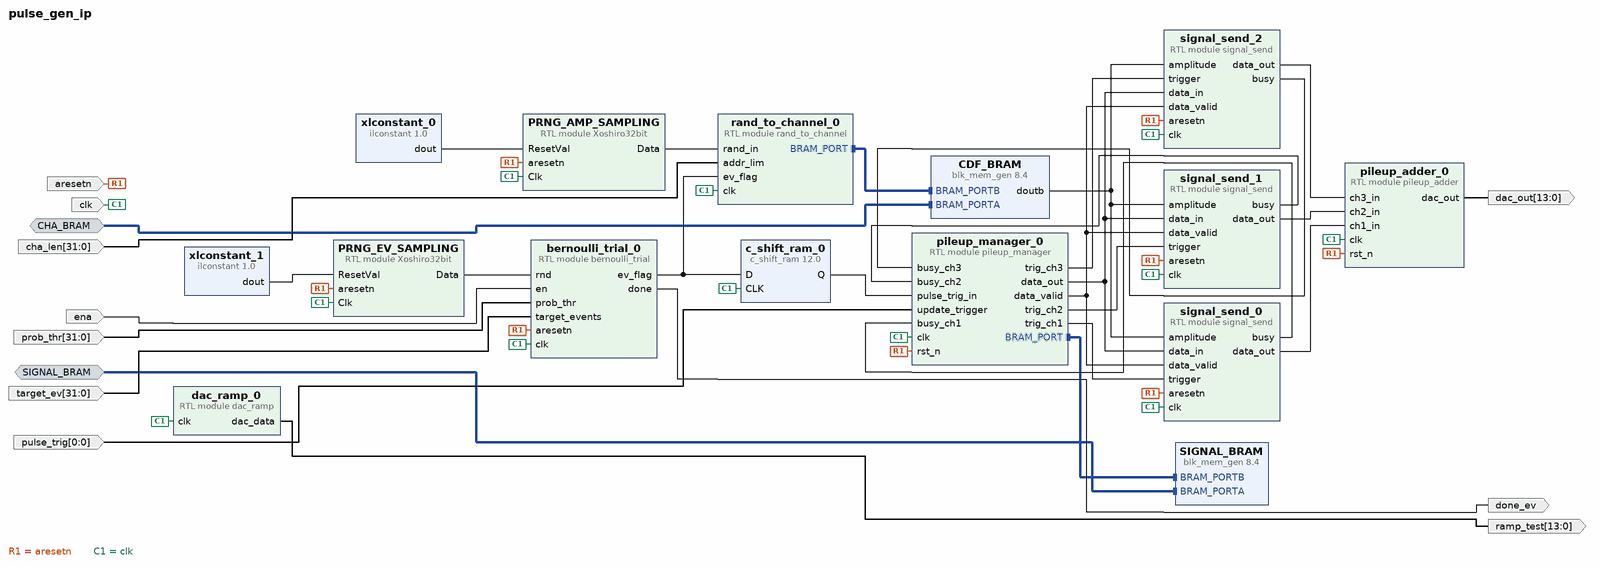
[diagram p0: block diagram of the top level]
# Vivado block design pulse_gen_ip, xck26-sfvc784-2LV-c, Vivado 2024.2
create_bd_design pulse_gen_ip

create_bd_intf_port -mode Slave -vlnv xilinx.com:interface:bram_rtl:1.0 SIGNAL_BRAM
set_property -dict {CONFIG.MASTER_TYPE BRAM_CTRL CONFIG.READ_WRITE_MODE READ_WRITE} [get_bd_intf_ports SIGNAL_BRAM]
create_bd_intf_port -mode Slave -vlnv xilinx.com:interface:bram_rtl:1.0 CHA_BRAM
set_property -dict [list \
  CONFIG.MASTER_TYPE BRAM_CTRL \
  CONFIG.MEM_SIZE 32768 \
  CONFIG.READ_WRITE_MODE READ_WRITE \
] [get_bd_intf_ports CHA_BRAM]
create_bd_port -dir I -from 0 -to 0 pulse_trig
create_bd_port -dir I -from 31 -to 0 prob_thr
create_bd_port -dir I ena
create_bd_port -dir I -from 31 -to 0 target_ev
create_bd_port -dir I -from 31 -to 0 cha_len
create_bd_port -dir I -type rst aresetn
create_bd_port -dir I -type clk clk
set_property -dict {CONFIG.FREQ_HZ 49999500} [get_bd_ports clk]
create_bd_port -dir O done_ev
create_bd_port -dir O -from 13 -to 0 ramp_test
create_bd_port -dir O -from 13 -to 0 dac_out

create_bd_cell -type module -reference dac_ramp dac_ramp_0
create_bd_cell -type ip -vlnv xilinx.com:ip:blk_mem_gen:8.4 SIGNAL_BRAM
set_property -dict {CONFIG.Memory_Type True_Dual_Port_RAM} [get_bd_cells SIGNAL_BRAM]
create_bd_cell -type module -reference pileup_manager pileup_manager_0
create_bd_cell -type module -reference signal_send signal_send_0
create_bd_cell -type module -reference signal_send signal_send_1
create_bd_cell -type module -reference pileup_adder pileup_adder_0
create_bd_cell -type module -reference signal_send signal_send_2
create_bd_cell -type module -reference Xoshiro32bit PRNG_EV_SAMPLING
create_bd_cell -type module -reference bernoulli_trial bernoulli_trial_0
create_bd_cell -type module -reference rand_to_channel rand_to_channel_0
create_bd_cell -type module -reference Xoshiro32bit PRNG_AMP_SAMPLING
create_bd_cell -type ip -vlnv xilinx.com:ip:blk_mem_gen:8.4 CDF_BRAM
set_property -dict {CONFIG.Memory_Type True_Dual_Port_RAM} [get_bd_cells CDF_BRAM]
create_bd_cell -type ip -vlnv xilinx.com:ip:c_shift_ram:12.0 c_shift_ram_0
set_property -dict {CONFIG.Depth 1 CONFIG.Width 1} [get_bd_cells c_shift_ram_0]
create_bd_cell -type inline_hdl -vlnv xilinx.com:inline_hdl:ilconstant:1.0 xlconstant_0
set_property -dict {CONFIG.CONST_VAL 24197857200151252728969465425480056815 CONFIG.CONST_WIDTH 128} [get_bd_cells xlconstant_0]
create_bd_cell -type inline_hdl -vlnv xilinx.com:inline_hdl:ilconstant:1.0 xlconstant_1
set_property -dict {CONFIG.CONST_VAL 24197857200151252728969465429440056815 CONFIG.CONST_WIDTH 128} [get_bd_cells xlconstant_1]

# ---- connections ----

connect_bd_intf_net -intf_net BRAM_PORTA1_0_1 [get_bd_intf_ports CHA_BRAM] [get_bd_intf_pins CDF_BRAM/BRAM_PORTA]
connect_bd_intf_net -intf_net BRAM_PORTA_0_1 [get_bd_intf_ports SIGNAL_BRAM] [get_bd_intf_pins SIGNAL_BRAM/BRAM_PORTA]
connect_bd_intf_net [get_bd_intf_pins pileup_manager_0/BRAM_PORT] [get_bd_intf_pins SIGNAL_BRAM/BRAM_PORTB]
connect_bd_intf_net [get_bd_intf_pins rand_to_channel_0/BRAM_PORT] [get_bd_intf_pins CDF_BRAM/BRAM_PORTB]
connect_bd_net [get_bd_pins bernoulli_trial_0/ev_flag] [get_bd_pins c_shift_ram_0/D] [get_bd_pins rand_to_channel_0/ev_flag]
connect_bd_net [get_bd_pins CDF_BRAM/doutb] \
  [get_bd_pins signal_send_0/amplitude] [get_bd_pins signal_send_1/amplitude] [get_bd_pins signal_send_2/amplitude]
connect_bd_net -net PRNG_PULSE_GEN_bram_sig [get_bd_pins pileup_adder_0/dac_out] [get_bd_ports dac_out]
connect_bd_net -net PRNG_PULSE_GEN_done [get_bd_pins bernoulli_trial_0/done] [get_bd_ports done_ev]
connect_bd_net -net PRNG_PULSE_GEN_ramp [get_bd_pins dac_ramp_0/dac_data] [get_bd_ports ramp_test]
connect_bd_net -net Xoshiro32bit_0_Data [get_bd_pins PRNG_AMP_SAMPLING/Data] [get_bd_pins rand_to_channel_0/rand_in]
connect_bd_net -net Xoshiro32bit_1_Data [get_bd_pins PRNG_EV_SAMPLING/Data] [get_bd_pins bernoulli_trial_0/rnd]
connect_bd_net -net addr_lim_0_1 [get_bd_ports cha_len] [get_bd_pins rand_to_channel_0/addr_lim]
connect_bd_net -net aresetn_0_1 [get_bd_ports aresetn] \
  [get_bd_pins pileup_manager_0/rst_n] [get_bd_pins pileup_adder_0/rst_n] [get_bd_pins signal_send_0/aresetn] \
  [get_bd_pins signal_send_1/aresetn] [get_bd_pins signal_send_2/aresetn] [get_bd_pins PRNG_AMP_SAMPLING/aresetn] \
  [get_bd_pins bernoulli_trial_0/aresetn] [get_bd_pins PRNG_EV_SAMPLING/aresetn]
connect_bd_net [get_bd_pins c_shift_ram_0/Q] [get_bd_pins pileup_manager_0/pulse_trig_in]
connect_bd_net -net clk_0_1 [get_bd_ports clk] \
  [get_bd_pins dac_ramp_0/clk] [get_bd_pins pileup_manager_0/clk] [get_bd_pins pileup_adder_0/clk] \
  [get_bd_pins signal_send_0/clk] [get_bd_pins signal_send_1/clk] [get_bd_pins signal_send_2/clk] \
  [get_bd_pins c_shift_ram_0/CLK] [get_bd_pins PRNG_AMP_SAMPLING/Clk] [get_bd_pins bernoulli_trial_0/clk] \
  [get_bd_pins rand_to_channel_0/clk] [get_bd_pins PRNG_EV_SAMPLING/Clk]
connect_bd_net -net en_0_1 [get_bd_ports ena] [get_bd_pins bernoulli_trial_0/en]
connect_bd_net [get_bd_pins pileup_manager_0/data_out] \
  [get_bd_pins signal_send_0/data_in] [get_bd_pins signal_send_1/data_in] [get_bd_pins signal_send_2/data_in]
connect_bd_net [get_bd_pins pileup_manager_0/data_valid] \
  [get_bd_pins signal_send_0/data_valid] [get_bd_pins signal_send_1/data_valid] [get_bd_pins signal_send_2/data_valid]
connect_bd_net [get_bd_pins pileup_manager_0/trig_ch1] [get_bd_pins signal_send_0/trigger]
connect_bd_net [get_bd_pins pileup_manager_0/trig_ch2] [get_bd_pins signal_send_1/trigger]
connect_bd_net [get_bd_pins pileup_manager_0/trig_ch3] [get_bd_pins signal_send_2/trigger]
connect_bd_net -net prob_thr_0_1 [get_bd_ports prob_thr] [get_bd_pins bernoulli_trial_0/prob_thr]
connect_bd_net [get_bd_pins signal_send_0/busy] [get_bd_pins pileup_manager_0/busy_ch1]
connect_bd_net -net signal_send_0_dac_out [get_bd_pins signal_send_0/data_out] [get_bd_pins pileup_adder_0/ch1_in]
connect_bd_net [get_bd_pins signal_send_1/busy] [get_bd_pins pileup_manager_0/busy_ch2]
connect_bd_net -net signal_send_1_dac_out [get_bd_pins signal_send_1/data_out] [get_bd_pins pileup_adder_0/ch2_in]
connect_bd_net [get_bd_pins signal_send_2/busy] [get_bd_pins pileup_manager_0/busy_ch3]
connect_bd_net [get_bd_pins signal_send_2/data_out] [get_bd_pins pileup_adder_0/ch3_in]
connect_bd_net -net target_events_0_1 [get_bd_ports target_ev] [get_bd_pins bernoulli_trial_0/target_events]
connect_bd_net -net update_trigger_0_1 [get_bd_ports pulse_trig] [get_bd_pins pileup_manager_0/update_trigger]
connect_bd_net [get_bd_pins xlconstant_0/dout] [get_bd_pins PRNG_AMP_SAMPLING/ResetVal]
connect_bd_net [get_bd_pins xlconstant_1/dout] [get_bd_pins PRNG_EV_SAMPLING/ResetVal]

validate_bd_design
save_bd_design
